# Altium schematic sheet SoC_ADC_DAC.SchDoc: RFSOC_AMC
size 420 x 297 mm; Author: G.Kasprowicz; CompanyName: WUT ISE; DrawnBy: G.Kasprowicz; Organization: WUT ISE; Address1: PW ISE; Address2: Nowowiejska 15/19 00-665 Warsaw; Address3: gkasprow@gmail.com; DocumentNumber: 30; Revision: 2; SheetNumber: 30; SheetTotal: 54; ModifiedBy: -; CheckedDate: -; Title2: 8 channel ADC & DAC; DivGrp: WUT ISE; Designer: G.Kasprowicz; ModifiedDate: -; ProjectName: Sensor Box
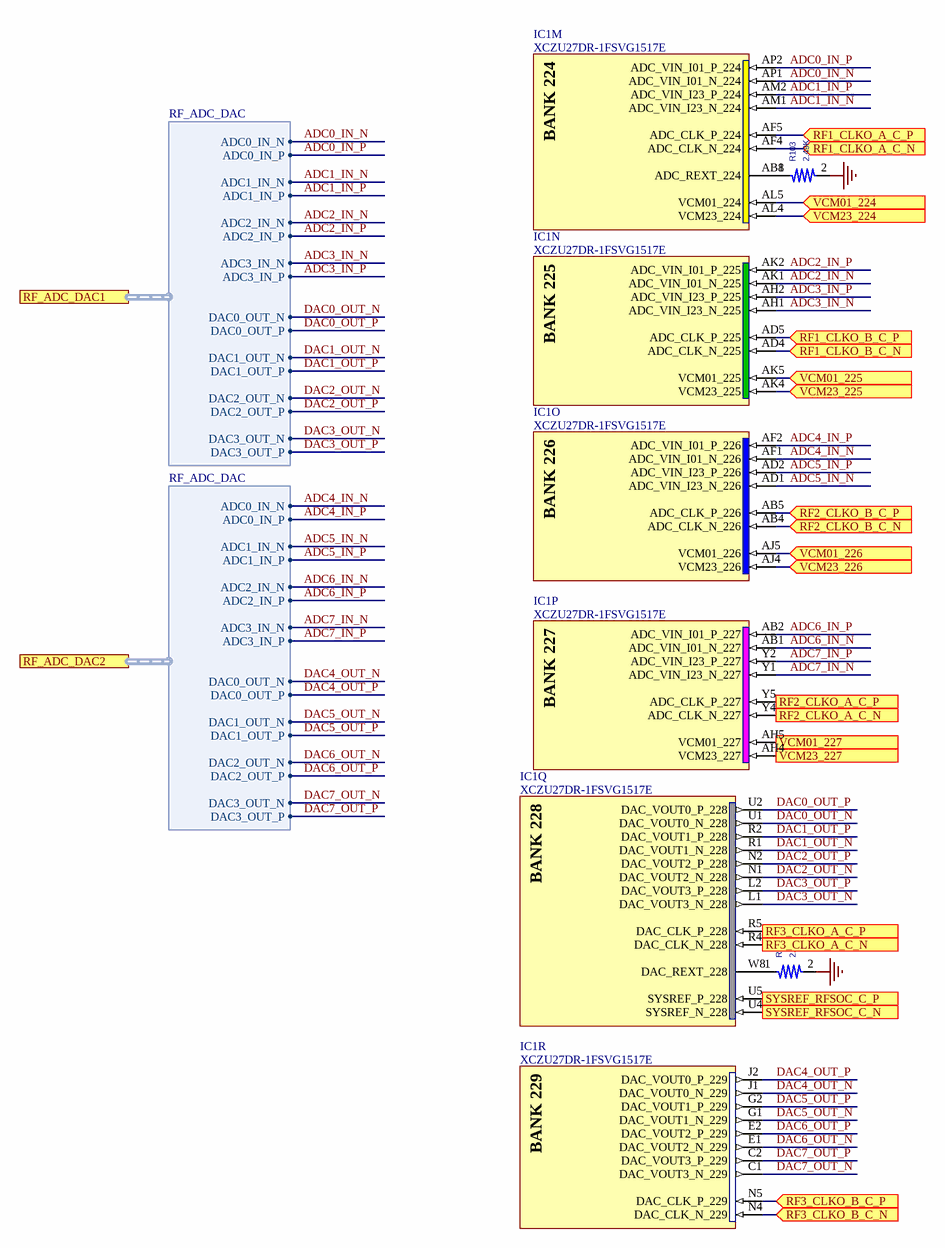
[diagram p0: SoC_ADC_DAC.SchDoc]

## Parts
IC1  XCZU27DR-1FSVG1517E  [XILINX_FSVG1517 (XCZU27DR)]  (parts M,N,O,P,Q,R of 31)
R103  2.49K  [0402]
R104  2.49K  [0402]

## Ports
RF1_CLKO_A_C_N (in), RF1_CLKO_A_C_P (in), RF1_CLKO_B_C_N (in), RF1_CLKO_B_C_P (in), RF2_CLKO_A_C_N (in), RF2_CLKO_A_C_P (in), RF2_CLKO_B_C_N (in), RF2_CLKO_B_C_P (in), RF3_CLKO_A_C_N (in), RF3_CLKO_A_C_P (in), RF3_CLKO_B_C_N (in), RF3_CLKO_B_C_P (in), RF_ADC_DAC1 (harness RF_ADC_DAC), RF_ADC_DAC2 (harness RF_ADC_DAC), SYSREF_RFSOC_C_N (in), SYSREF_RFSOC_C_P (in), VCM01_224 (in), VCM01_225 (in), VCM01_226 (in), VCM01_227 (in), VCM23_224 (in), VCM23_225 (in), VCM23_226 (in), VCM23_227 (in)

## Harnesses
RF_ADC_DAC: ADC0_IN_N, ADC0_IN_P, ADC1_IN_N, ADC1_IN_P, ADC2_IN_N, ADC2_IN_P, ADC3_IN_N, ADC3_IN_P, DAC0_OUT_N, DAC0_OUT_P, DAC1_OUT_N, DAC1_OUT_P, DAC2_OUT_N, DAC2_OUT_P, DAC3_OUT_N, DAC3_OUT_P

## Nets
GND: R103.2 R104.2
ADC0_IN_N: IC1.AP1(ADC_VIN_I01_N_224) ; port RF_ADC_DAC1.ADC0_IN_N
ADC0_IN_P: IC1.AP2(ADC_VIN_I01_P_224) ; port RF_ADC_DAC1.ADC0_IN_P
ADC1_IN_N: IC1.AM1(ADC_VIN_I23_N_224) ; port RF_ADC_DAC1.ADC1_IN_N
ADC1_IN_P: IC1.AM2(ADC_VIN_I23_P_224) ; port RF_ADC_DAC1.ADC1_IN_P
ADC2_IN_N: IC1.AK1(ADC_VIN_I01_N_225) ; port RF_ADC_DAC1.ADC2_IN_N
ADC2_IN_P: IC1.AK2(ADC_VIN_I01_P_225) ; port RF_ADC_DAC1.ADC2_IN_P
ADC3_IN_N: IC1.AH1(ADC_VIN_I23_N_225) ; port RF_ADC_DAC1.ADC3_IN_N
ADC3_IN_P: IC1.AH2(ADC_VIN_I23_P_225) ; port RF_ADC_DAC1.ADC3_IN_P
ADC4_IN_N: IC1.AF1(ADC_VIN_I01_N_226) ; port RF_ADC_DAC2.ADC0_IN_N
ADC4_IN_P: IC1.AF2(ADC_VIN_I01_P_226) ; port RF_ADC_DAC2.ADC0_IN_P
ADC5_IN_N: IC1.AD1(ADC_VIN_I23_N_226) ; port RF_ADC_DAC2.ADC1_IN_N
ADC5_IN_P: IC1.AD2(ADC_VIN_I23_P_226) ; port RF_ADC_DAC2.ADC1_IN_P
ADC6_IN_N: IC1.AB1(ADC_VIN_I01_N_227) ; port RF_ADC_DAC2.ADC2_IN_N
ADC6_IN_P: IC1.AB2(ADC_VIN_I01_P_227) ; port RF_ADC_DAC2.ADC2_IN_P
ADC7_IN_N: IC1.Y1(ADC_VIN_I23_N_227) ; port RF_ADC_DAC2.ADC3_IN_N
ADC7_IN_P: IC1.Y2(ADC_VIN_I23_P_227) ; port RF_ADC_DAC2.ADC3_IN_P
DAC0_OUT_N: IC1.U1(DAC_VOUT0_N_228) ; port RF_ADC_DAC1.DAC0_OUT_N
DAC0_OUT_P: IC1.U2(DAC_VOUT0_P_228) ; port RF_ADC_DAC1.DAC0_OUT_P
DAC1_OUT_N: IC1.R1(DAC_VOUT1_N_228) ; port RF_ADC_DAC1.DAC1_OUT_N
DAC1_OUT_P: IC1.R2(DAC_VOUT1_P_228) ; port RF_ADC_DAC1.DAC1_OUT_P
DAC2_OUT_N: IC1.N1(DAC_VOUT2_N_228) ; port RF_ADC_DAC1.DAC2_OUT_N
DAC2_OUT_P: IC1.N2(DAC_VOUT2_P_228) ; port RF_ADC_DAC1.DAC2_OUT_P
DAC3_OUT_N: IC1.L1(DAC_VOUT3_N_228) ; port RF_ADC_DAC1.DAC3_OUT_N
DAC3_OUT_P: IC1.L2(DAC_VOUT3_P_228) ; port RF_ADC_DAC1.DAC3_OUT_P
DAC4_OUT_N: IC1.J1(DAC_VOUT0_N_229) ; port RF_ADC_DAC2.DAC0_OUT_N
DAC4_OUT_P: IC1.J2(DAC_VOUT0_P_229) ; port RF_ADC_DAC2.DAC0_OUT_P
DAC5_OUT_N: IC1.G1(DAC_VOUT1_N_229) ; port RF_ADC_DAC2.DAC1_OUT_N
DAC5_OUT_P: IC1.G2(DAC_VOUT1_P_229) ; port RF_ADC_DAC2.DAC1_OUT_P
DAC6_OUT_N: IC1.E1(DAC_VOUT2_N_229) ; port RF_ADC_DAC2.DAC2_OUT_N
DAC6_OUT_P: IC1.E2(DAC_VOUT2_P_229) ; port RF_ADC_DAC2.DAC2_OUT_P
DAC7_OUT_N: IC1.C1(DAC_VOUT3_N_229) ; port RF_ADC_DAC2.DAC3_OUT_N
DAC7_OUT_P: IC1.C2(DAC_VOUT3_P_229) ; port RF_ADC_DAC2.DAC3_OUT_P
RF1_CLKO_A_C_N: IC1.AF4(ADC_CLK_N_224) ; port RF1_CLKO_A_C_N
RF1_CLKO_A_C_P: IC1.AF5(ADC_CLK_P_224) ; port RF1_CLKO_A_C_P
RF1_CLKO_B_C_N: IC1.AD4(ADC_CLK_N_225) ; port RF1_CLKO_B_C_N
RF1_CLKO_B_C_P: IC1.AD5(ADC_CLK_P_225) ; port RF1_CLKO_B_C_P
RF2_CLKO_A_C_N: IC1.Y4(ADC_CLK_N_227) ; port RF2_CLKO_A_C_N
RF2_CLKO_A_C_P: IC1.Y5(ADC_CLK_P_227) ; port RF2_CLKO_A_C_P
RF2_CLKO_B_C_N: IC1.AB4(ADC_CLK_N_226) ; port RF2_CLKO_B_C_N
RF2_CLKO_B_C_P: IC1.AB5(ADC_CLK_P_226) ; port RF2_CLKO_B_C_P
RF3_CLKO_A_C_N: IC1.R4(DAC_CLK_N_228) ; port RF3_CLKO_A_C_N
RF3_CLKO_A_C_P: IC1.R5(DAC_CLK_P_228) ; port RF3_CLKO_A_C_P
RF3_CLKO_B_C_N: IC1.N4(DAC_CLK_N_229) ; port RF3_CLKO_B_C_N
RF3_CLKO_B_C_P: IC1.N5(DAC_CLK_P_229) ; port RF3_CLKO_B_C_P
SYSREF_RFSOC_C_N: IC1.U4(SYSREF_N_228) ; port SYSREF_RFSOC_C_N
SYSREF_RFSOC_C_P: IC1.U5(SYSREF_P_228) ; port SYSREF_RFSOC_C_P
VCM01_224: IC1.AL5(VCM01_224) ; port VCM01_224
VCM01_225: IC1.AK5(VCM01_225) ; port VCM01_225
VCM01_226: IC1.AJ5(VCM01_226) ; port VCM01_226
VCM01_227: IC1.AH5(VCM01_227) ; port VCM01_227
VCM23_224: IC1.AL4(VCM23_224) ; port VCM23_224
VCM23_225: IC1.AK4(VCM23_225) ; port VCM23_225
VCM23_226: IC1.AJ4(VCM23_226) ; port VCM23_226
VCM23_227: IC1.AH4(VCM23_227) ; port VCM23_227
NetIC1_AB8: IC1.AB8(ADC_REXT_224) R103.1
NetIC1_W8: IC1.W8(DAC_REXT_228) R104.1

## Notes on the sheet
- Project/Equipment
- Document
- Designer
- Drawn by
- Check.by
- Copyright WUT ISE 2019.
  This documentation describes Open Hardware and is licensed under the CERN OHL v.1.1. You may redistribute and modify this documentation under the terms of the CERN OHL v.1.1. (http://ohwr.org/CERNOHL). This documentation is distributed WITHOUT ANY EXPRESS OR IMPLIED WARRANTY, INCLUDING OF MERCHANTABILITY, SATISFACTORY QUALITY AND FITNESS FOR A PARTICULAR PURPOSE. Please see the CERN OHL v.1.1 for applicable conditions.
- Contact
- File
- Last Mod.
- Print Date
- Sheet
- Size
- A3
- of
- Rev
- (in symbol XCZU27DR-1FSVG1517E, part M) BANK 224
- (in symbol XCZU27DR-1FSVG1517E, part N) BANK 225
- (in symbol XCZU27DR-1FSVG1517E, part O) BANK 226
- (in symbol XCZU27DR-1FSVG1517E, part P) BANK 227
- (in symbol XCZU27DR-1FSVG1517E, part Q) BANK 228
- (in symbol XCZU27DR-1FSVG1517E, part R) BANK 229

## Library data of the parts
IC1 = XCZU27DR-1FSVG1517E: Zynq UltraScale+ RFSoC, Quad-Core ARM® Cortex™-A53 MPCore™ up to 1.5GHz, 214 PS I/O, 299 HP I/O, 48 HD I/O, 1517-Pin BGA; Manufacturer: XILINX; PressFit: No; Bonding: No; Part Number: XCZU27DR-1FSVG1517E; Component Kind: Standard; Component Type: Standard; Device: XCZU27DR-1FSVG1517E; PackageDescription: BGA, 1.00mm Pitch, Square; 1517 Pin, 39 Columns X 39 Rows, 40.00mm X 40.00mm X 4.01mm H; Part Description: Zynq UltraScale+ RFSoC, Quad-Core ARM® Cortex™-A53 MPCore™ up to 1.5GHz, 214 PS I/O, 299 HP I/O, 48 HD I/O, 1517-Pin BGA; Manufacturer Part Number: XCZU27DR-1FSVG1517E; Pin Count: 1517; Case: BGA1517; Mounted: Yes; Socket: No; SMD: Yes; Sense: No; ComponentHeight: 4.01mm; HelpURL: \\cern.ch\dfs\Applications\Altium\Datasheets\XCZU27DR-1FSVG1517E.pdf; ComponentLink1URL: \\cern.ch\dfs\Applications\Altium\Datasheets\XCZU27DR-1FSVG1517E_Package-Pinout.pdf; ComponentLink1Description: Package/Pinout; ComponentLink2URL: \\cern.ch\dfs\Applications\Altium\Datasheets\XCZU27DR-1FSVG1517E_Pinout.pdf; ComponentLink2Description: Pinout; Author: CERN DEM MR; CreateDate: 02/05/2018; LatestRevisionDate: 02/05/2018
R103 R104 = RES: Barcode: 200049; Power: 1/10W; Tolerance: 1%; MANF: PANASONIC; MANF_P/N: ERJ-2RKF2491X; OWNER: 10460; DEVICE: 2_49K_0402; primarykey: 161; PartType: SMT - 1%; Datasheet: \\XSJ-SMB\AFX\AFX\BOARD_PROJECTS\LIBRARY\\DATASHEETS\RESISTOR\PANA_ERJ_1%.PDF; ROHS: Yes; PRICE: 0